# EAGLE design drill_charger (EAGLE 9.3.1)
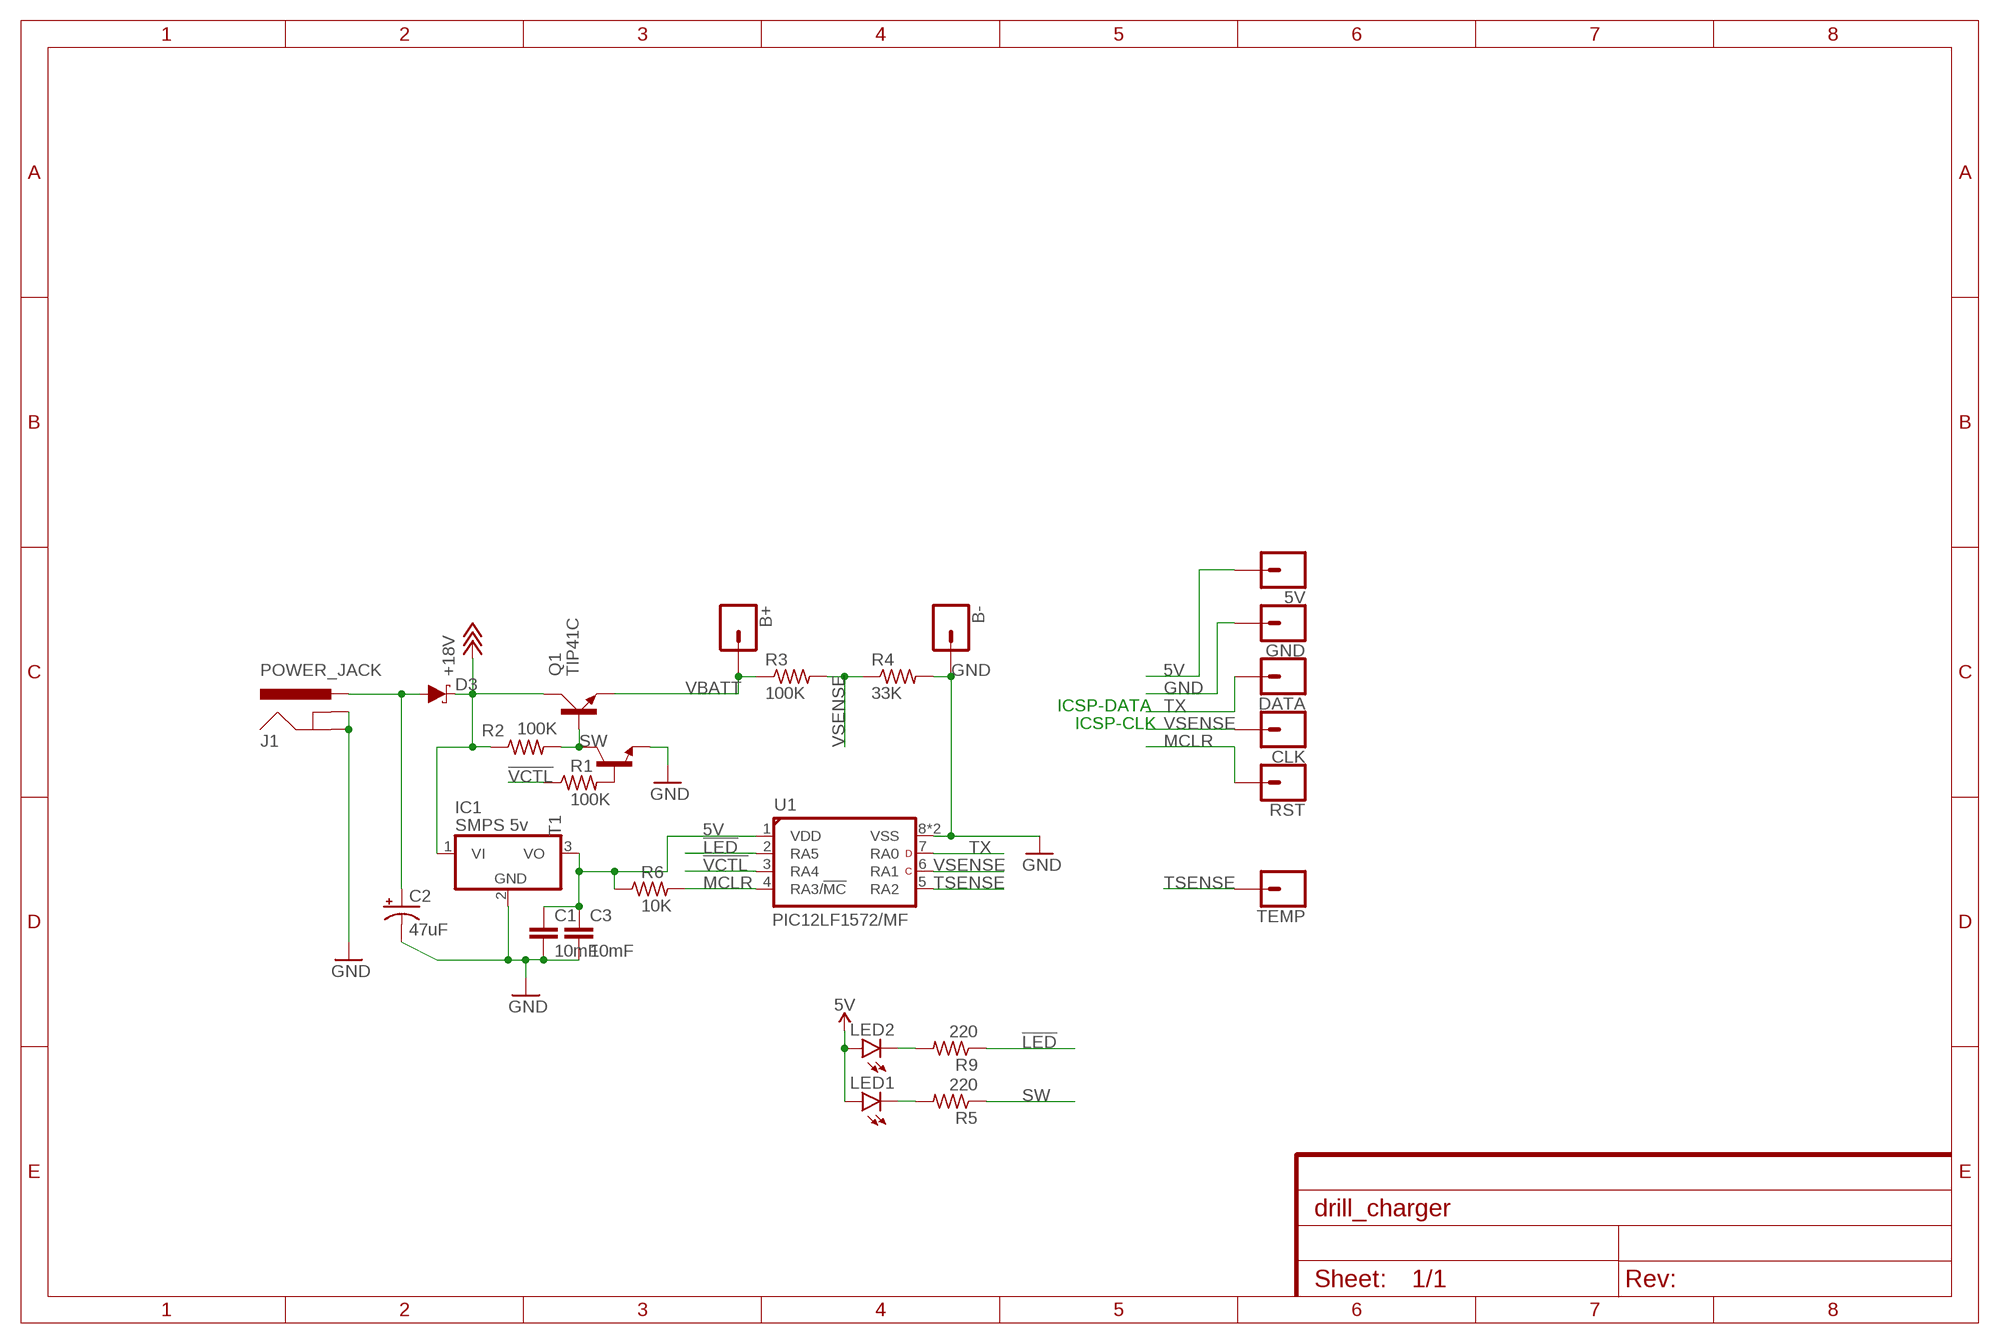
[diagram p0: schematic, sheet 1]

## Parts
5V  CONN_01  [1X01]
B+  CONN_01  [1X01]
B-  CONN_01  [1X01]
C1  10mF  C-EUC0805  [C0805]
C2  47uF  100UF-POLAR-RADIAL-2.5MM-25V-20%  [CPOL-RADIAL-2.5MM-6.5MM]
C3  10mF  C-EUC0805  [C0805]
CLK  CONN_01  [1X01]
D3  1A/40V/500mV  DIODE-SCHOTTKY-SS14  [SMA-DIODE]
DATA  CONN_01  [1X01]
GND  CONN_01  [1X01]
IC1  SMPS 5v  7805TV  [TO220V]
J1  POWER_JACK  [POWER_JACK_PTH]
LED1  LED3MM  [LED3MM]
LED2  LED3MM  [LED3MM]
Q1  TIP41C  [TO220AV]
R1  100K  R-US_R0805  [R0805]
R2  100K  R-US_R0805  [R0805]
R3  100K  R-US_R1206  [R1206]
R4  33K  R-US_R1206  [R1206]
R5  220  R-US_R0805  [R0805]
R6  10K  R-US_R0805  [R0805]
R9  220  R-US_R0805  [R0805]
RST  CONN_01  [1X01]
T1  MMBT3904LT1-NPN-SOT23-BEC  [SOT23-BEC]
TEMP  CONN_01  [1X01]
U1  PIC12LF1572/MF  [DFN8-MF]

## Nets
5V: 5V.1 C1.1 C3.1 IC1.3(VO) LED1.A LED2.A R6.1 U1.1(VDD)
!LED: R9.1 U1.2(RA5)
!VCTL: R1.1 U1.3(RA4)
+18V: D3.C IC1.1(VI) Q1.C R2.1
GND: B-.1 C1.2 C2.2(-) C3.2 GND.1 IC1.2(GND) J1.GND J1.GNDBREAK R4.2 T1.E U1.8(VSS) U1.EP(VSS)
MCLR: R6.2 RST.1 U1.4(RA3/!MC!)
N$2: LED2.K(C) R9.2
N$4: LED1.K(C) R5.2
N$6: C2.1(+) D3.A J1.PWR
N$8: R1.2 T1.B
SW: Q1.B R2.2 R5.1 T1.C
TSENSE: TEMP.1 U1.5(RA2)
TX: DATA.1 U1.7(RA0)
VBATT: B+.1 Q1.E R3.1
VSENSE: CLK.1 R3.2 R4.1 U1.6(RA1)

## Notes on the sheet
- ICSP-DATA
- ICSP-CLK

## Library data of the parts
5V B+ B- CLK DATA GND RST TEMP = SparkFun-Connectors:CONN_01: Single connection point. Often used as Generic Header-pin footprint for 0.1 inch spaced/style header connections On any of the 0.1 inch spaced packages, you can populate with these: Break Away Headers - Straight <https://www.sparkfun.com/products/116> (PRT-00116) Break Away Male Headers - Right Angle <https://www.sparkfun.com/products/553> (PRT-00553) Female Headers <https://www.sparkfun.com/products/115> (PRT-00115) Break Away Headers - Machine Pin <https://www.sparkfun.com/products/117> (PRT-00117) Break Away Female Headers - Swiss Machine Pin <https://www.sparkfun.com/products/743> (PRT-00743) This device is also useful as a general connection point to wire up your design to another part of your project. Our various solder wires solder well into these plated through hole pads. Hook-Up Wire - Assortment (Stranded, 22 AWG) <https://www.sparkfun.com/products/11375> (PRT-11375) Hook-Up Wire - Assortment (Solid Core, 22 AWG) <https://www.sparkfun.com/products/11367> (PRT-11367) View the entire wire category on our website here <https://www.sparkfun.com/categories/141> Special notes: SMTSO-256-ET is a "flush mount" nut for a 4-40 screw. We mostly use this on specialty testbeds; it is a nice way to connect hardware to your PCB at an adjustable hieght. Also note, the SNAP packages are for using a snappable style connector. We sell a baggie of snaps and they are also used on two LilyPad designs: Snap Assortment - 30 pack (male and female) <https://www.sparkfun.com/products/11347> (DEV-11347) LilyPad Arduino SimpleSnap <https://www.sparkfun.com/products/10941> (DEV-10941) LilyPad SimpleSnap Protoboard <https://www.sparkfun.com/products/10940> (DEV-10940)
C1 C3 = resistor:C-EU: CAPACITOR, European symbol
C2 = SparkFun-Capacitors:100UF-POLAR: 100µF polarized capacitors A capacitor is a passive two-terminal electrical component used to store electrical energy temporarily in an electric field.; PROD_ID: CAP-08439; VALUE: 100uF
D3 = SparkFun-DiscreteSemi:DIODE-SCHOTTKY: Schottky diode A Schottky diode is a semiconductor diode which has a low forward voltage drop and a very fast switching action.; PROD_ID: DIO-08053
IC1 = linear:78*: Positive VOLTAGE REGULATOR Source: http://cache.national.com/ds/LM/LM78L05.pdf http://www.fairchildsemi.com/ds/LM/LM7805.pdf
J1 = SparkFun-Connectors:POWER_JACK: Power Jack Connector This is the standard 5.5mm barrel jack for power. The PTH is the most common, proven, reliable, footprint. The Slot footprint only works if the mill layer is transmitted to the PCB fab house so be warned. Here are the connectors we sell at SparkFun: DC Barrel Power Jack/Connector <https://www.sparkfun.com/products/119> (PRT-00119) DC Barrel Power Jack/Connector (SMD) <https://www.sparkfun.com/products/12748> (PRT-12748) DC Barrel Jack Adapter - Breadboard Compatible <https://www.sparkfun.com/products/10811> (PRT-10811) It is used on this SparkFun product (and many, many others): SparkFun RedBoard - Programmed with Arduino <https://www.sparkfun.com/products/12757> (DEV-12757) Also, if you need a mating power supply or connector, please check these out: Wall Adapter Power Supply - 9VDC 650mA <https://www.sparkfun.com/products/298> (TOL-00298) DC Barrel Jack Adapter - Male <https://www.sparkfun.com/products/10287> (PRT-10287); PROD_ID: CONN-08197
LED1 LED2 = led:LED: LED OSRAM: - CHIPLED LG R971, LG N971, LY N971, LG Q971, LY Q971, LO R971, LY R971 LH N974, LH R974 LS Q976, LO Q976, LY Q976 LO Q996 - Hyper CHIPLED LW Q18S LB Q993, LB Q99A, LB R99A - SideLED LS A670, LO A670, LY A670, LG A670, LP A670 LB A673, LV A673, LT A673, LW A673 LH A674 LY A675 LS A676, LA A676, LO A676, LY A676, LW A676 LS A679, LY A679, LG A679 - Hyper Micro SIDELED® LS Y876, LA Y876, LO Y876, LY Y876 LT Y87S - SmartLED LW L88C, LW L88S LB L89C, LB L89S, LG L890 LS L89K, LO L89K, LY L89K LS L896, LA L896, LO L896, LY L896 - TOPLED LS T670, LO T670, LY T670, LG T670, LP T670 LSG T670, LSP T670, LSY T670, LOP T670, LYG T670 LG T671, LOG T671, LSG T671 LB T673, LV T673, LT T673, LW T673 LH T674 LS T676, LA T676, LO T676, LY T676, LB T676, LH T676, LSB T676, LW T676 LB T67C, LV T67C, LT T67C, LS T67K, LO T67K, LY T67K, LW E67C LS E67B, LA E67B, LO E67B, LY E67B, LB E67C, LV E67C, LT E67C LW T67C LS T679, LY T679, LG T679 LS T770, LO T770, LY T770, LG T770, LP T770 LB T773, LV T773, LT T773, LW T773 LH T774 LS E675, LA E675, LY E675, LS T675 LS T776, LA T776, LO T776, LY T776, LB T776 LHGB T686 LT T68C, LB T68C - Hyper Mini TOPLED® LB M676 - Mini TOPLED Santana® LG M470 LS M47K, LO M47K, LY M47K Source: http://www.osram.convergy.de LUXEON: - LUMILED® LXK2-PW12-R00, LXK2-PW12-S00, LXK2-PW14-U00, LXK2-PW14-V00 LXK2-PM12-R00, LXK2-PM12-S00, LXK2-PM14-U00 LXK2-PE12-Q00, LXK2-PE12-R00, LXK2-PE12-S00, LXK2-PE14-T00, LXK2-PE14-U00 LXK2-PB12-K00, LXK2-PB12-L00, LXK2-PB12-M00, LXK2-PB14-N00, LXK2-PB14-P00, LXK2-PB14-Q00 LXK2-PR12-L00, LXK2-PR12-M00, LXK2-PR14-Q00, LXK2-PR14-R00 LXK2-PD12-Q00, LXK2-PD12-R00, LXK2-PD12-S00 LXK2-PH12-R00, LXK2-PH12-S00 LXK2-PL12-P00, LXK2-PL12-Q00, LXK2-PL12-R00 Source: www.luxeon.com KINGBRIGHT: KA-3528ASYC Source: www.kingbright.com
Q1 = transistor-power:TIP41C: NPN TRANSISTOR
R1-R6 R9 = resistor:R-US_: RESISTOR, American symbol
T1 = transistor-neu-to92:*-NPN-: NPN Transistror
U1 = microchip_pic12f:PIC12*F1572: Low pincount microcontroller http://www.microchip.com/wwwproducts/Devices.aspx?product=PIC12F1572 Properties Parameter Name Value Program Memory Type Flash Program Memory (KB) 3.5 CPU Speed (MIPS) 8 RAM Bytes 256 Digital Communication Peripherals 1-UART, Capture/Compare/PWM Peripherals 3 Timers 2 x 8-bit, 4 x 16-bit ADC 4 ch, 10-bit Comparators 1 Temperature Range (C) -40 to 125 Operating Voltage Range (V) 1.8 to 5.5 Pin Count 8 Cap Touch Channels 4 Features Enhanced Mid-range Core with 49 Instruction, 16 Stack Levels Flash Program Memory with self read/write capability 128 Bytes of Non-Volatile Data Storage, High-Endurance Flash (HEF) Internal clock speeds from 31kHz to 32MHz 3x Standalone 16-bit PWMs Complementary Waveform Generator (CWG) 4 Channel 10-bit ADC with Voltage Reference 5-bit Digital to Analog Converter (DAC) Comparator 2x 8-bit Timers (TMR0/TMR2) 1x 16-bit Timer (TMR1) Three additional 16-bit Timers available using the 16-bit PWMs Extended Watchdog Timer (WDT) Enhanced Power-On/Off-Reset Low-Power Brown-Out Reset (LPBOR) Programmable Brown-Out Reset (BOR) In Circuit Serial Programming (ICSP) PIC12LF1572 (1.8V – 3.6V) PIC12F1572 (2.3V – 5.5V) Library from www.mikroelektroniikka.fi/lbr

## Board
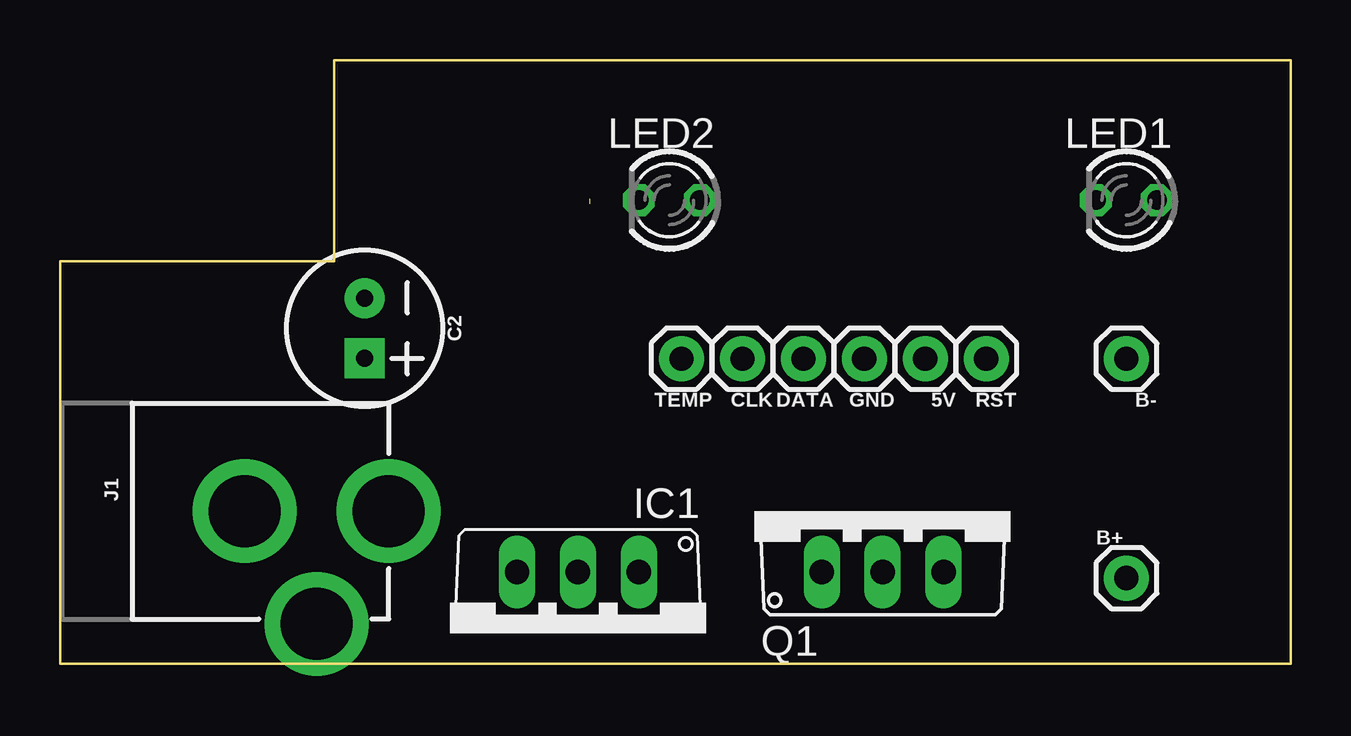
[diagram p1: board, top side]
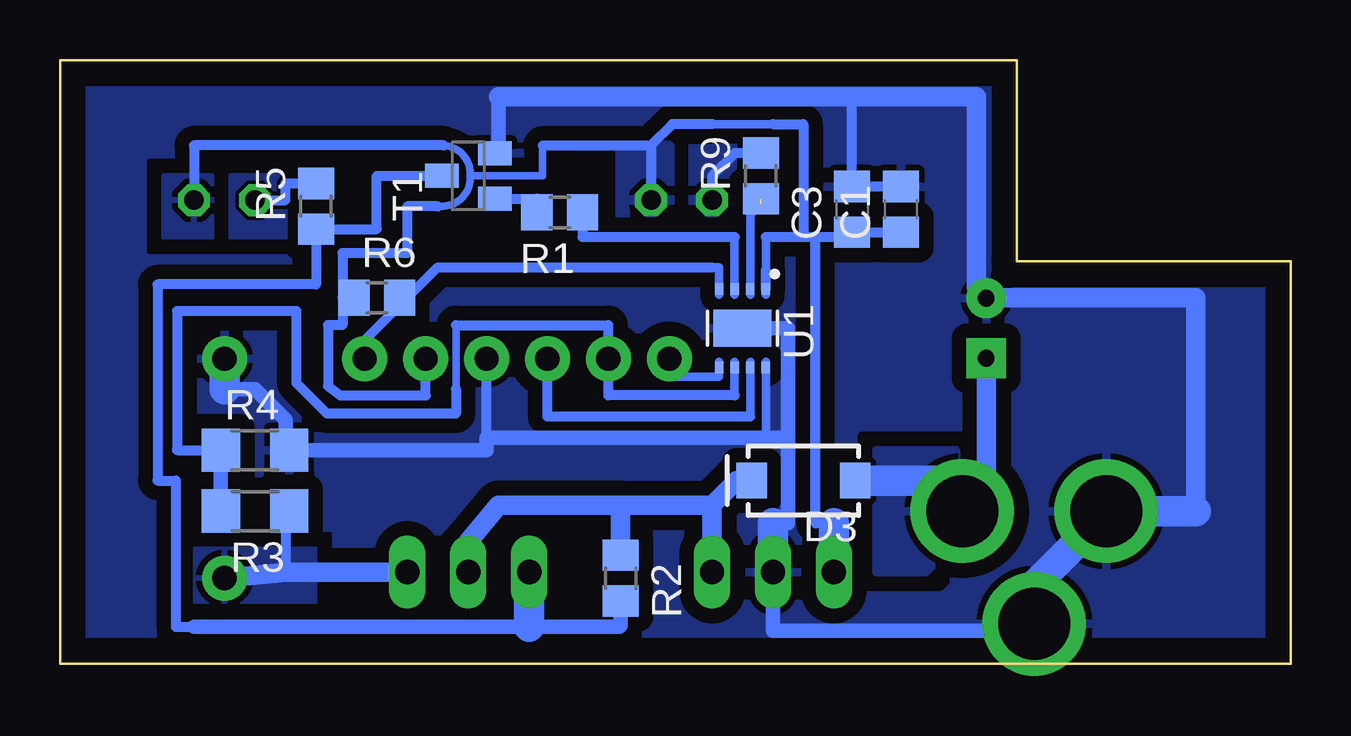
[diagram p2: board, bottom side, seen from below]

Size 51.31 x 25.15 mm. Coordinates in mm from the lower left corner, seen from the top.
Outline: 0,0 51.31,0 51.31,25.15 11.43,25.15 11.43,16.76 0,16.76 0,0
Copper layers (1*16): Top 0.035mm / dielectric 1.5mm / Bottom 0.035mm
Design rules "default": minimum track width 6mil, minimum drill 0.35mm, track to track 6mil, track to pad 6mil, pad to pad 6mil, via to via 6mil, smd to smd 6mil, copper to edge 40mil, drill to drill 6mil, minimum pad ring 10mil, minimum via ring 8mil, stop-mask expansion 4mil, vias tented up to drill 0mil, thermal gap 10mil

### Footprints (pad centres in the part's own frame; a part is rotated, then mirrored left to right if it is on the bottom)
1X01 = drill 1.016 pad 1.88: 1 0,0
C0805 = smd 1.3 x 1.5: 1 -0.95,0; 2 0.95,0
CPOL-RADIAL-2.5MM-6.5MM = drill 0.7 pad 1.651 square: 1 1.25,0 | drill 0.7 pad 1.651: 2 -1.25,0
SMA-DIODE = smd 1.27 x 1.47: A -2.15,0; C 2.15,0
TO220V = drill 1.016 long: 1 -2.54,-2.54; 2 0,-2.54; 3 2.54,-2.54
POWER_JACK_PTH = drill 2.997 pad 4.318: GND 0,7.7; GNDBREAK 4.7,10.7; PWR 0,13.7
LED3MM = drill 0.813 octagon: A -1.27,0; K 1.27,0
TO220AV = drill 1.016 long: B -2.54,-2.54; C 0,-2.54; E 2.54,-2.54
R0805 = smd 1.3 x 1.5: 1 -0.95,0; 2 0.95,0
R1206 = smd 1.6 x 1.803: 1 -1.422,0; 2 1.422,0
SOT23-BEC = smd 1 x 1.4: B -0.95,-1.1; C 0,1.1; E 0.95,-1.1
DFN8-MF = smd 0.35 x 0.475: 1 -0.975,-1.637; 2 -0.325,-1.637; 3 0.325,-1.637; 4 0.975,-1.637; 5 0.975,1.637; 6 0.325,1.637; 7 -0.325,1.637; 8 -0.975,1.637 | smd 2.4 x 1.55: EP 0,0

### Placement (x,y rotation side)
5V  36.07,12.7 180 top
B+  44.45,3.56 0 top
B-  44.45,12.7 180 top
C1  16.26,18.92 90 bottom
C2  12.7,13.97 270 top
C3  18.29,18.92 90 bottom
CLK  28.45,12.7 180 top
D3  20.32,7.62 180 bottom
DATA  30.99,12.7 180 top
GND  33.53,12.7 180 top
IC1  21.59,1.27 180 top
J1  0,6.35 270 top
LED1  44.45,19.3 180 top
LED2  25.4,19.3 180 top
Q1  34.29,6.35 0 top
R1  30.48,18.8 180 bottom
R2  27.94,3.56 270 bottom
R3  43.18,6.35 180 bottom
R4  43.18,8.89 0 bottom
R5  40.64,19.05 90 bottom
R6  38.1,15.24 0 bottom
R9  22.1,20.32 90 bottom
RST  38.61,12.7 180 top
T1  34.29,20.32 90 bottom
TEMP  25.91,12.7 180 top
U1  22.86,13.97 180 bottom

### Tracks (layer width: path | path; a pad name or v marks a point on that pad's centre or on a via)
5V
  Bottom 0.305: 31.19,21.59 31.19,20.32 34.21,20.32 | 34.21,20.32 arc90 35.31,19.05 35.56,19.05 | 34.21,20.32 arc-90 35.31,21.59
  Bottom 0.356: U1.1 21.88,17.78 | 24.13,22.48 21.59,22.48 21.08,22.48
  Bottom 0.406: 21.88,17.78 20.32,17.78 | 20.32,17.78 19.81,17.78 | C1.1 C3.1 18.48,17.78 19.81,17.78 | 21.59,22.48 20.32,22.48 20.32,17.78 | 24.13,22.48 25.78,22.48 26.67,21.59 | LED1.A 45.72,21.59 35.31,21.59 | 5V.1 36.07,11.18 39.62,11.18 40.13,11.56 40.13,14.1 39.53,14.1 39.53,15.24 | 26.92,19.05 LED2.A 26.67,21.59 | 31.19,21.59 26.67,21.59 | U1.1 21.88,16.37 | 19.05,5.84 19.81,5.84 19.81,17.78 | 39.53,15.24 39.53,17.09 36.83,17.09 36.83,19.05 35.56,19.05 | R6.1 39.53,15.24
  Bottom 1.27: IC1.3 19.05,5.84
  pour Bottom (rank 2): 45.72,20.32 46.99,20.32 46.99,17.78 44.96,17.78 44.96,20.32
  pour Bottom (isolate 0.61): 25.91,20.32 25.91,19.05 25.91,18.29 27.94,18.29 27.94,21.59 25.91,21.59
!LED  (1 unrouted)
  Bottom 0.356: U1.2 22.54,18.73 22.1,19.16
!VCTL
  Bottom 0.356: 23.18,17.78 U1.3
  Bottom 0.406: 23.18,17.78 29.53,17.78 R1.1
+18V
  Bottom 0.813: D3.C 23.11,7.62 24.13,6.6 | 24.13,6.6 IC1.1 | 27.94,6.6 24.13,6.6 | R2.1 27.94,6.6 | 27.94,6.6 33.02,6.6 34.29,5.08 Q1.C
GND
  Bottom 0.356: U1.8 21.88,9.4
  Bottom 0.406: 21.88,13.97 U1.EP | 33.53,9.4 GND.1 | T1.E 33.02,21.27 | R4.2 41.91,8.89 | C1.2 C3.2 18.29,23.62 17.78,23.62
  Bottom 0.61: B-.1 44.6,12.55 | 14.99,23.62 15.24,23.62 | 17.02,23.62 16.51,23.62 | 21.88,13.97 20.95,13.97 20.95,9.4 | J1.GNDBREAK 10.98,1.37 21.59,1.37 IC1.2 | 20.95,9.4 21.88,9.4 33.53,9.4 33.53,8.89 R4.2 | 33.02,21.27 33.02,23.62 | 20.95,9.4 20.95,5.84 21.59,5.84 | 41.91,8.89 41.91,10.16 43.18,11.43 44.45,11.43
  Bottom 0.813: 33.02,23.62 17.78,23.62 16.51,23.62 15.24,23.62 13.11,23.62 13.11,15.65 12.7,15.24 3.96,15.24 3.96,6.35
  Bottom 1.27: J1.GNDBREAK 10.7,3.27 7.62,6.35 J1.GND 3.96,6.35 | 21.59,5.84 IC1.2 | 44.45,11.43 B-.1
  pour Bottom (isolate 0.61, rank 5): 0,25.4 52.07,25.4 52.07,0 0,0
MCLR
  Bottom 0.356: U1.4 23.84,16.51 24.13,16.51
  Bottom 0.406: 24.13,16.51 35.56,16.51 36.83,15.24 | RST.1 38.61,13.46 36.83,15.24 | R6.2 36.83,15.24
N$2
  Bottom 0.406: R9.2 23.18,21.27 24.13,20.32 LED2.K
  pour Bottom (isolate 0.61): 24.89,21.59 22.86,21.59 22.86,18.29 24.89,18.29
N$3
  pour Bottom (rank 2): 41.91,20.32 44.2,20.32 44.2,17.78 41.91,17.78
N$4
  Bottom 0.406: 42.93,19.3 LED1.K 41.91,19.3 41.91,20 R5.2
N$6
  Bottom 0.813: C2.1 12.7,6.35 J1.PWR
  Bottom 1.27: J1.PWR 13.97,6.62 13.97,7.62 D3.A
  pour Bottom (isolate 0.61): 13.97,8.89 17.27,8.89 17.27,3.81 15.24,3.81 13.97,5.08
N$8
  Bottom 0.406: 33.19,19.3 T1.B 31.43,19.37 R1.2
SW
  Bottom 0.406: T1.C 38.1,20.32 38.1,18.1 R5.1 40.64,15.8 47.24,15.8 47.24,7.62 46.48,7.62 46.48,1.52 45.72,1.52
  Bottom 0.61: 45.72,1.52 31.75,1.52 27.99,1.52 27.94,1.57 R2.2
  Bottom 1.27: Q1.B 31.75,1.52
TSENSE
  Bottom 0.356: U1.5 23.84,11.94 25.91,11.94 TEMP.1
TX
  Bottom 0.356: U1.7 22.54,10.29
  Bottom 0.406: DATA.1 30.99,10.29 22.54,10.29
VBATT
  Bottom 0.406: R3.1 41.91,6.35 41.91,3.81
  Bottom 0.813: B+.1 41.91,3.81 Q1.E
  pour Bottom: 45.72,2.54 40.64,2.54 40.64,4.83 45.72,4.83
VSENSE
  Bottom 0.305: 34.8,11.43 34.8,14.1
  Bottom 0.356: U1.6 23.18,11.18
  Bottom 0.406: 23.18,11.18 28.45,11.18 CLK.1 28.45,14.1 34.8,14.1 | 34.8,11.43 34.8,10.41 40.18,10.41 41.45,11.68 41.45,14.68 46.43,14.68 46.43,8.89 R4.1
  Bottom 0.61: R4.1 R3.2

### Text on the board
tDocu: PGC / PGD/TX / GND / 5V / MCLR | B- / / / / / B+